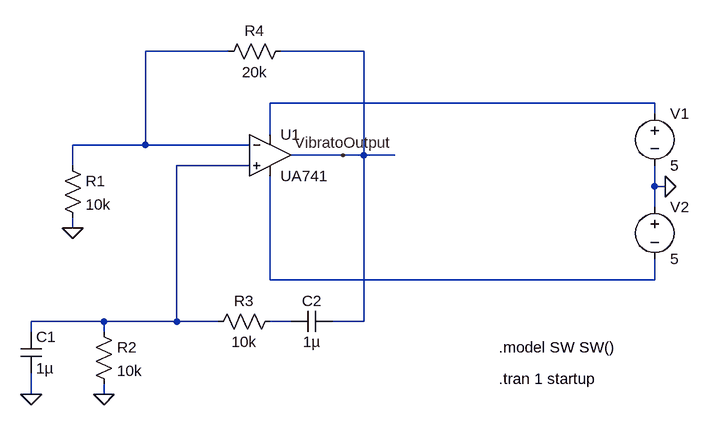
[diagram p0: schematic Vibrato.asc]
Vibrato.asc, the LTspice schematic file:
Version 4
SHEET 1 880 680
WIRE -128 -240 -256 -240
WIRE 80 -240 -48 -240
WIRE 528 -160 -64 -160
WIRE 528 -144 528 -160
WIRE -64 -112 -64 -160
WIRE -256 -96 -256 -240
WIRE -256 -96 -368 -96
WIRE -96 -96 -256 -96
WIRE 48 -80 -32 -80
WIRE 80 -80 80 -240
WIRE 80 -80 48 -80
WIRE 128 -80 80 -80
WIRE -368 -64 -368 -96
WIRE -96 -64 -208 -64
WIRE 528 -32 528 -64
WIRE 544 -32 528 -32
WIRE 528 0 528 -32
WIRE -368 32 -368 16
WIRE -64 112 -64 -48
WIRE 528 112 528 80
WIRE 528 112 -64 112
WIRE -320 176 -432 176
WIRE -208 176 -208 -64
WIRE -208 176 -320 176
WIRE -144 176 -208 176
WIRE -32 176 -64 176
WIRE 80 176 80 -80
WIRE 80 176 32 176
WIRE -432 192 -432 176
WIRE -320 192 -320 176
WIRE -432 288 -432 256
WIRE -320 288 -320 272
FLAG -368 32 0
FLAG -432 288 0
FLAG -320 288 0
FLAG 544 -32 0
FLAG 48 -80 VibratoOutput
SYMBOL Opamps/opamp2 -64 -144 R0
SYMATTR InstName U1
SYMATTR Value UA741
SYMBOL res -384 -80 R0
SYMATTR InstName R1
SYMATTR Value 10k
SYMBOL cap -448 192 R0
SYMATTR InstName C1
SYMATTR Value 1µ
SYMBOL cap 32 160 R90
WINDOW 0 0 32 VBottom 2
WINDOW 3 32 32 VTop 2
SYMATTR InstName C2
SYMATTR Value 1µ
SYMBOL res -336 176 R0
SYMATTR InstName R2
SYMATTR Value 10k
SYMBOL res -48 160 R90
WINDOW 0 0 56 VBottom 2
WINDOW 3 32 56 VTop 2
SYMATTR InstName R3
SYMATTR Value 10k
SYMBOL res -32 -256 R90
WINDOW 0 0 56 VBottom 2
WINDOW 3 32 56 VTop 2
SYMATTR InstName R4
SYMATTR Value 20k
SYMBOL voltage 528 -160 R0
SYMATTR InstName V1
SYMATTR Value 5
SYMBOL voltage 528 -16 R0
SYMATTR InstName V2
SYMATTR Value 5
TEXT 288 264 Left 2 !.tran 1 startup
TEXT 288 216 Left 2 !.model SW SW()

The netlist it stands for:
* Vibrato.asc
XU1 N003 N001 N002 N004 VibratoOutput UA741  ; pins In+ In- V+ V- OUT
R1 N001 0 10k
C1 N003 0 1µ
C2 VibratoOutput N005 1µ
R2 N003 0 10k
R3 N005 N003 10k
R4 VibratoOutput N001 20k
V1 N002 0 5
V2 0 N004 5
.tran 1 startup
.model SW SW()
.backanno
.end